# EAGLE design Pinduino-Nano-WPC-adaptor (EAGLE 7.3.0)
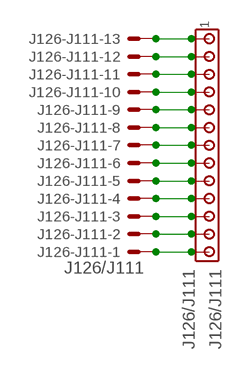
[diagram p0: schematic, sheet 1]

## Parts
J126-J111  J126/J111  KK-156-13  [KK-156-13]
J126/J111  J126/J111  MTA13-156  [1X13MTA]

## Nets
N$19: J126-J111.3 J126/J111.11
N$20: J126-J111.2 J126/J111.12
N$21: J126-J111.12 J126/J111.2
N$22: J126-J111.13 J126/J111.1
N$23: J126-J111.4 J126/J111.10
N$25: J126-J111.1 J126/J111.13
N$27: J126-J111.9 J126/J111.5
N$58: J126-J111.6 J126/J111.8
N$59: J126-J111.7 J126/J111.7
N$62: J126-J111.8 J126/J111.6
N$64: J126-J111.5 J126/J111.9
N$65: J126-J111.10 J126/J111.4
N$66: J126-J111.11 J126/J111.3

## Library data of the parts
J126-J111 = con-molex:KK-156-13: KK 156 HEADER Source: http://www.molex.com/pdm_docs/sd/026604100_sd.pdf; OC_FARNELL: unknown; OC_NEWARK: unknown
J126/J111 = con-amp:MTA13-156: AMP connector

## Net classes
0 default: width 0.406 mm
1 Power: width 0.61 mm
2 GND: width 0.61 mm

## Board
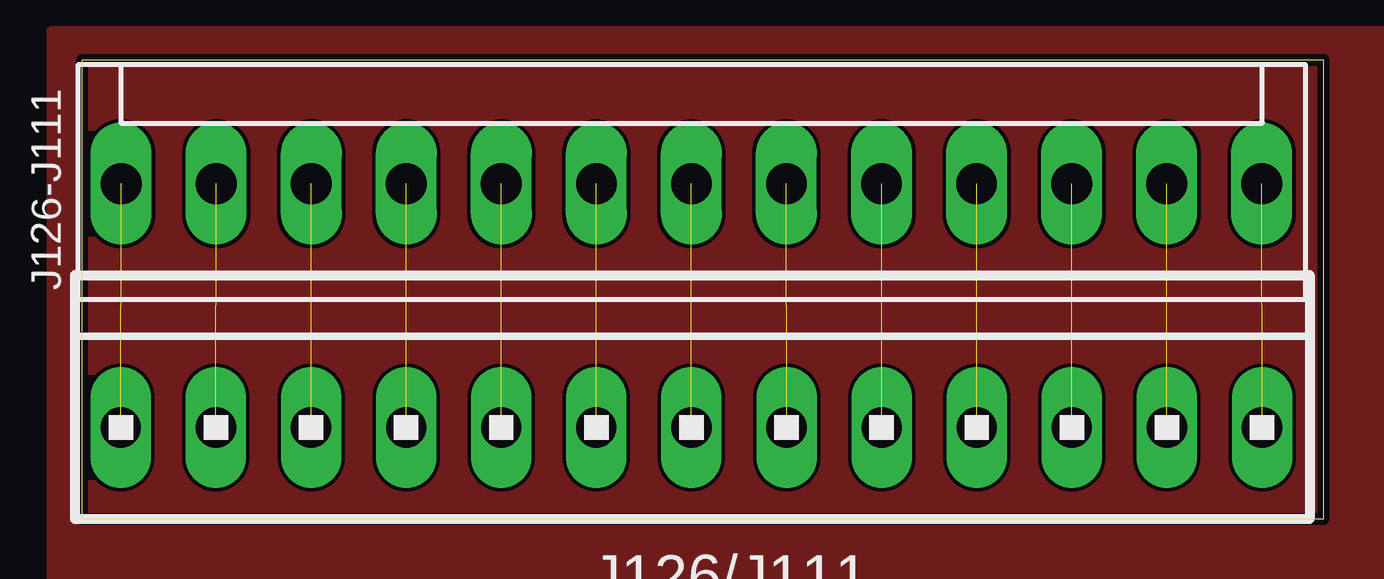
[diagram p1: board, top side]
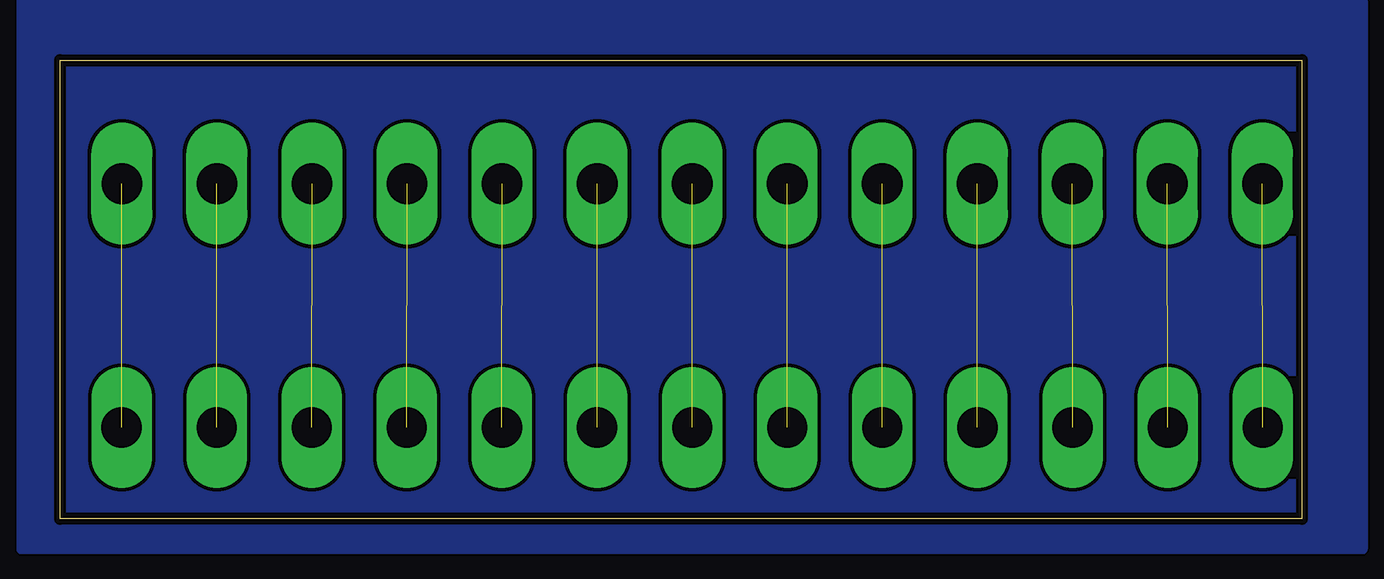
[diagram p2: board, bottom side, seen from below]

Size 51.74 x 19.12 mm. Coordinates in mm from the lower left corner, seen from the top.
Outline: 0,0 51.74,0 51.74,19.12 0,19.12 0,0
Copper layers (1*16): Top 0.035mm / dielectric 1.5mm / Bottom 0.035mm
Design rules "SeeedStudio_2layer_DRU_no_angle_20140221": minimum track width 6mil, minimum drill 12mil, track to track 6mil, track to pad 6mil, pad to pad 6mil, via to via 6mil, smd to smd 0mil, copper to edge 10mil, drill to drill 10mil, minimum pad ring 10mil, minimum via ring 6mil, stop-mask expansion 2mil, vias tented up to drill 100mil, thermal gap 10mil

### Footprints (pad centres in the part's own frame; a part is rotated, then mirrored left to right if it is on the bottom)
KK-156-13 = drill 1.7 pad 2.184 long: 1 -23.76,0; 2 -19.8,0; 3 -15.84,0; 4 -11.88,0; 5 -7.92,0; 6 -3.96,0; 7 0,0; 8 3.96,0; 9 7.92,0; 10 11.88,0; 11 15.84,0; 12 19.8,0; 13 23.76,0
1X13MTA = drill 1.676 long: 1 23.774,0; 2 19.812,0; 3 15.85,0; 4 11.887,0; 5 7.925,0; 6 3.962,0; 7 0,0; 8 -3.962,0; 9 -7.925,0; 10 -11.887,0; 11 -15.85,0; 12 -19.812,0; 13 -23.774,0

### Placement (x,y rotation side)
J126-J111  25.4,13.97 0 top
J126/J111  25.4,3.81 0 top

### Tracks (layer width: path | path; a pad name or v marks a point on that pad's centre or on a via)
GND
  pour Top: -1.27,20.32 -1.27,-2.54 54.61,-2.54 54.61,20.32
  pour Bottom: -2.54,21.59 -2.54,-1.27 53.34,-1.27 53.34,21.59
N$19  (1 unrouted)
N$20  (1 unrouted)
N$21  (1 unrouted)
N$22  (1 unrouted)
N$23  (1 unrouted)
N$25  (1 unrouted)
N$27  (1 unrouted)
N$58  (1 unrouted)
N$59  (1 unrouted)
N$62  (1 unrouted)
N$64  (1 unrouted)
N$65  (1 unrouted)
N$66  (1 unrouted)